# Altium schematic sheet base-board.SchDoc
size A4
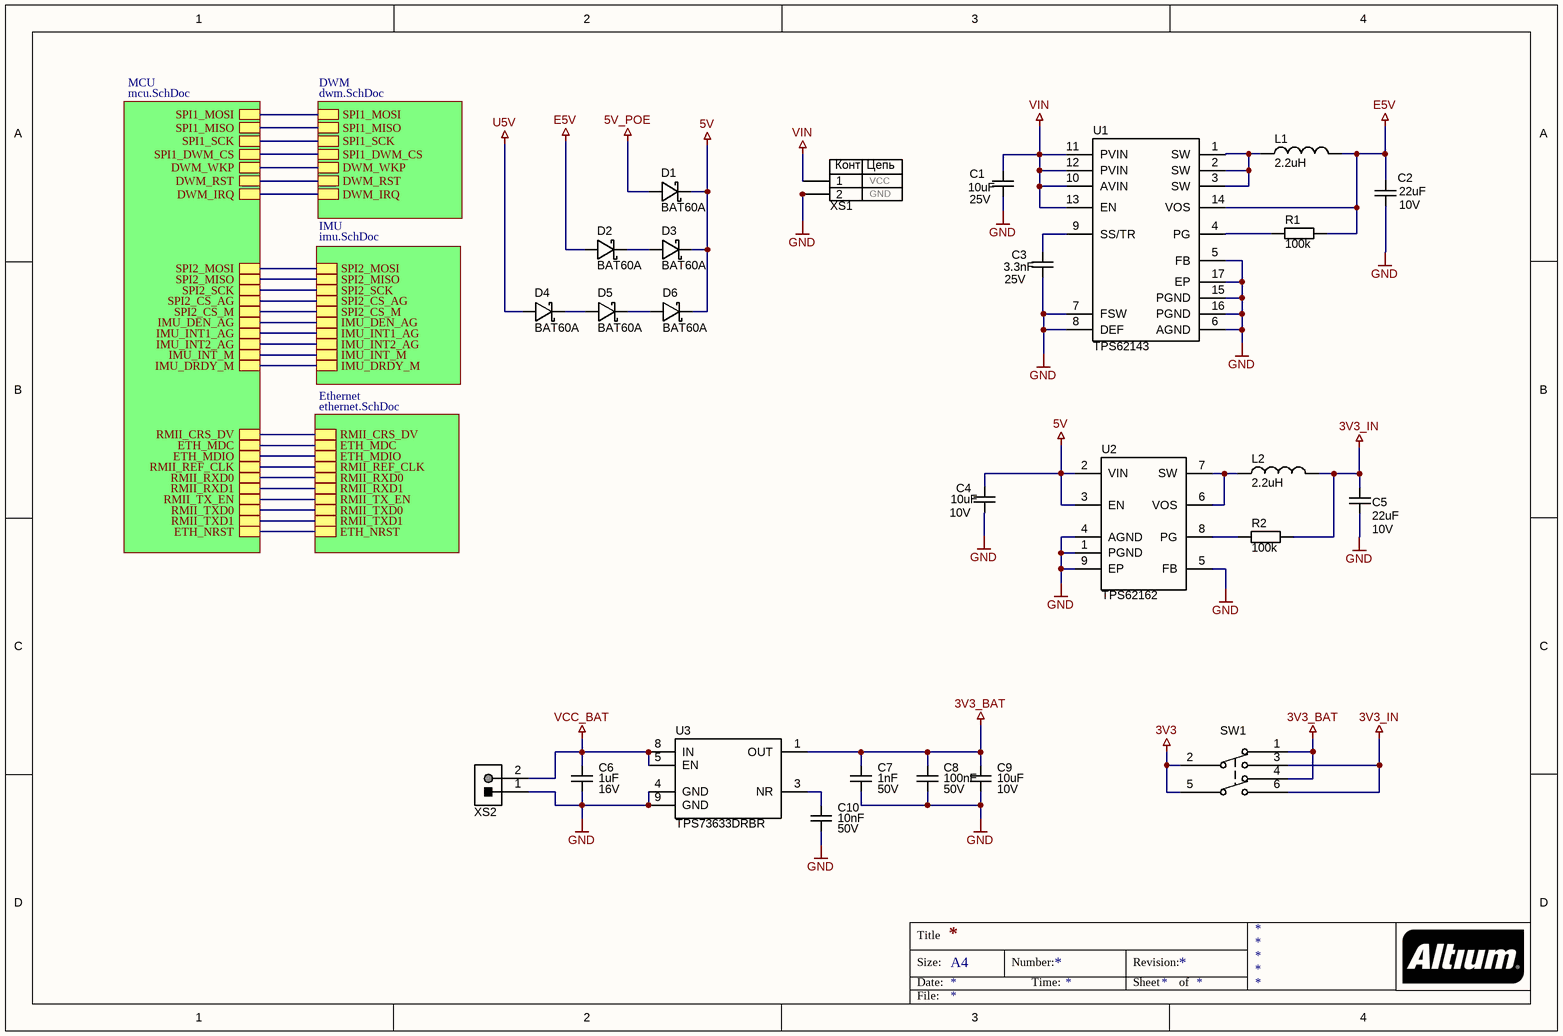
[diagram p0: base-board.SchDoc]

## Parts
C1  value 10uF  Voltage: 25V  [C1210]  (hidden comment: C1210)
C2  value 22uF  Voltage: 10V  [C1210]  (hidden comment: C1210)
C3  value 3.3nF  Voltage: 25V  [C0603]  (hidden comment: C0603)
C4  value 10uF  Voltage: 10V  [C0805]  (hidden comment: C0805)
C5  value 22uF  Voltage: 10V  [C0805]  (hidden comment: C0805)
C6  value 1uF  Voltage: 16V  [C0805]  (hidden comment: C0805)
C7  value 1nF  Voltage: 50V  [C0805]  (hidden comment: C0805)
C8  value 100nF  Voltage: 50V  [C0603]  (hidden comment: C0603)
C9  value 10uF  Voltage: 10V  [C0603]  (hidden comment: C0603)
C10  value 10nF  Voltage: 50V  [C0603]  (hidden comment: C0603)
D1  BAT60A  [SOD-323-2]
D2  BAT60A  [SOD-323-2]
D3  BAT60A  [SOD-323-2]
D4  BAT60A  [SOD-323-2]
D5  BAT60A  [SOD-323-2]
D6  BAT60A  [SOD-323-2]
L1  value 2.2uH  [IND2220]  (hidden comment: LQH55PN2R2NR0)
L2  value 2.2uH  [IND2220]  (hidden comment: LQH55PN2R2NR0)
R1  value 100k  [SMD0603]  (hidden comment: R0603)
R2  value 100k  [SMD0603]  (hidden comment: R0603)
SW1  JS202011SCQN  [JS202011SCQN]  (value not drawn)
U1  TPS62143  [QFN-16]
U2  TPS62162  [SON-8]
U3  TPS73633DRBR  [VSON-8]
XS1  PowerJack  [PowerJack]  (value not drawn)
XS2  S2B-PH-K-S  [S2B-PH-K-S]  (value not drawn)

## Sub-sheets
DWM = dwm.SchDoc: SPI1_MISO, SPI1_MOSI, SPI1_DWM_CS, SPI1_SCK, DWM_WKP, DWM_RST, DWM_IRQ
Ethernet = ethernet.SchDoc: RMII_CRS_DV, ETH_MDC, ETH_MDIO, RMII_REF_CLK, RMII_RXD0, RMII_RXD1, RMII_TX_EN, RMII_TXD0, RMII_TXD1, ETH_NRST
IMU = imu.SchDoc: SPI2_MOSI, SPI2_MISO, SPI2_SCK, SPI2_CS_AG, SPI2_CS_M, IMU_DEN_AG, IMU_INT1_AG, IMU_INT2_AG, IMU_INT_M, IMU_DRDY_M
MCU = mcu.SchDoc: SPI1_MISO, SPI1_MOSI, SPI1_DWM_CS, SPI1_SCK, SPI2_MOSI, SPI2_MISO, SPI2_SCK, SPI2_CS_AG, SPI2_CS_M, IMU_DEN_AG, IMU_INT1_AG, IMU_INT2_AG, IMU_INT_M, IMU_DRDY_M, RMII_CRS_DV, ETH_MDC, ETH_MDIO, RMII_REF_CLK, RMII_RXD0, RMII_RXD1, RMII_TX_EN, RMII_TXD0, RMII_TXD1, DWM_WKP, DWM_RST, DWM_IRQ, ETH_NRST

## Nets
3V3: SW1.2(COM) SW1.5(COM)
3V3_BAT: C7.2 C8.2 C9.2 SW1.1 SW1.4 U3.1(OUT)
3V3_IN: C5.2 L2.2 R2.2 SW1.3 SW1.6
5V: C4.2 D1.2(K) D3.2(K) D6.2(K) U2.2(VIN) U2.3(EN)
5V_POE: D1.1(A)
E5V: C2.2 D2.1(A) L1.2 R1.2 U1.14(VOS)
GND: C1.1 C2.1 C3.1 C4.1 C5.1 C6.1 C7.1 C8.1 C9.1 C10.1 U1.5(FB) U1.6(AGND) U1.7(FSW) U1.8(DEF) U1.15(PGND) U1.16(PGND) U1.17(EP) U2.1(PGND) U2.4(AGND) U2.5(FB) U2.9(EP) U3.4(GND) U3.9(GND) XS1.2 XS1.3 XS2.1
U5V: D4.1(A)
VCC_BAT: C6.2 U3.5(EN) U3.8(IN) XS2.2
VIN: C1.2 U1.10(AVIN) U1.11(PVIN) U1.12(PVIN) U1.13(EN) XS1.1
NetC3_2: C3.2 U1.9(SS/TR)
NetC10_2: C10.2 U3.3(NR)
NetD2_2: D2.2(K) D3.1(A)
NetD4_2: D4.2(K) D5.1(A)
NetD5_2: D5.2(K) D6.1(A)
NetL1_1: L1.1 U1.1(SW) U1.2(SW) U1.3(SW)
NetL2_1: L2.1 U2.6(VOS) U2.7(SW)
NetR1_1: R1.1 U1.4(PG)
NetR2_1: R2.1 U2.8(PG)
(unnamed): sheet MCU/SPI1_MISO, sheet DWM/SPI1_MISO
(unnamed): sheet MCU/SPI1_MOSI, sheet DWM/SPI1_MOSI
(unnamed): sheet MCU/SPI1_DWM_CS, sheet DWM/SPI1_DWM_CS
(unnamed): sheet MCU/SPI1_SCK, sheet DWM/SPI1_SCK
(unnamed): sheet MCU/SPI2_MOSI, sheet IMU/SPI2_MOSI
(unnamed): sheet MCU/SPI2_MISO, sheet IMU/SPI2_MISO
(unnamed): sheet MCU/SPI2_SCK, sheet IMU/SPI2_SCK
(unnamed): sheet MCU/SPI2_CS_AG, sheet IMU/SPI2_CS_AG
(unnamed): sheet MCU/SPI2_CS_M, sheet IMU/SPI2_CS_M
(unnamed): sheet MCU/IMU_DEN_AG, sheet IMU/IMU_DEN_AG
(unnamed): sheet MCU/IMU_INT1_AG, sheet IMU/IMU_INT1_AG
(unnamed): sheet MCU/IMU_INT2_AG, sheet IMU/IMU_INT2_AG
(unnamed): sheet MCU/IMU_INT_M, sheet IMU/IMU_INT_M
(unnamed): sheet MCU/IMU_DRDY_M, sheet IMU/IMU_DRDY_M
(unnamed): sheet MCU/RMII_CRS_DV, sheet Ethernet/RMII_CRS_DV
(unnamed): sheet MCU/ETH_MDC, sheet Ethernet/ETH_MDC
(unnamed): sheet MCU/ETH_MDIO, sheet Ethernet/ETH_MDIO
(unnamed): sheet MCU/RMII_REF_CLK, sheet Ethernet/RMII_REF_CLK
(unnamed): sheet MCU/RMII_RXD0, sheet Ethernet/RMII_RXD0
(unnamed): sheet MCU/RMII_RXD1, sheet Ethernet/RMII_RXD1
(unnamed): sheet MCU/RMII_TX_EN, sheet Ethernet/RMII_TX_EN
(unnamed): sheet MCU/RMII_TXD0, sheet Ethernet/RMII_TXD0
(unnamed): sheet MCU/RMII_TXD1, sheet Ethernet/RMII_TXD1
(unnamed): sheet MCU/DWM_WKP, sheet DWM/DWM_WKP
(unnamed): sheet MCU/DWM_RST, sheet DWM/DWM_RST
(unnamed): sheet MCU/DWM_IRQ, sheet DWM/DWM_IRQ
(unnamed): sheet MCU/ETH_NRST, sheet Ethernet/ETH_NRST

## Notes on the sheet
- Title
- Size:
- Date:
- A4
- Number:
- Time:
- Revision:
- Sheet
- of
- File:
- (in symbol PowerJack) Конт; Цепь; VCC; GND

## Library data of the parts
D1-D6 = BAT60J: Shottky Diode 10V 3A
L1 L2 = LQH55PN2R2NR0: FIXED IND 2.2UH 2.5A 31 MOHM SMD; Model: LQH55PN2R2NR0
SW1 = JS202011SCQN: Switch Slide DPDT, 0.3 A, 6 V, -40 to 85 degC, 6-Pin SMD, RoHS, Tape and Reel; Manufacturer: C&K Components; Contact Rating @ Voltage: 0.3@6VDCA; COO: US; Maximum DC Voltage Rating: 6V; Minimum Insulation Resistance: 100MOhm; Actuator Color: Black; Body Orientation: Straight; Actuator Material: Nylon4/6; Dielectric Strength: 500VAC; Maximum Contact Resistance: 70mOhm; Actuator Style: TopSlide; Electrical Life: 15000Cycles; Seal Location: N/A; Base Material: N/A; Mechanical Life: N/A; Switch Configuration: N/A; HTS: 8536509050; Contact Material: CopperAlloy; Supplier Standard Pack: 5,000; Manufacturer URL: http://www.ckswitches.com; Supplier: C&KComponents; Datasheet URL: http://datasheet.octopart.com/JS202011SCQN-C%26K-Components-datasheet-62100994.pdf; Housing Material: Nylon4/6; Product Weight: N/A; Dimension: 9x7.5x5.5mm; Maximum AC Voltage Rating: N/A; ECCN: EAR99; Contact Plating: Silver; Pole Throw Configuration: DPDT; Packaging: TapeandReel; Part No: JS202011SCQN; Datasheet Version: Sep-15; Seal Description: N/A; RoHS: Yes; Mounting: SurfaceMount,GullWing; Family: JS; Type: Sub-Miniature; Operating Temperature: -40to85C
U1 = TPS62143RGT16: Buck 2A TI Fix 5V
U2 = TPS62162DSG8: Buck 1A TI Fix 3.3V
U3 = TPS73633DRBR: IC REG LINEAR 3.3V 400MA 8SON
XS2 = S2B-PH-K-S: Male Header, Pitch 2 mm, 1 x 2 Position, Height 4.8 mm, Tail Length 3.4 mm, -25 to 85 degC, RoHS, Bulk; Case\Package: Radial; Tolerance: 20%; Capacitance: 10 uF; Voltage Rating (DC): 50 V; Packaging: Bulk; ComponentLink1URL: http://www.jst-mfg.com/product/pdf/eng/ePH.pdf; Radiation Hardening: No; Height: 11 mm; Package Quantity: 200; PackageDescription: Male Header, Pitch 2 mm, 1 x 2 Position, Height 4.8 mm, Tail Length 3.4 mm; PackageReference: S2B-PH-K-S; Diameter: 5 mm; Pins: 2; Mount: Through Hole; Max Operating Temperature: 85 degC; Min Operating Temperature: -40 degC; ComponentLink1Description: Datasheet; DatasheetVersion: Dec-12; Length: 11 mm; Lead Pitch: 2 mm; REACH SVHC: No SVHC; Voltage Rating: 50 V; RoHSCompliant: true
C1 C2 = C1210: Model: *
C3 C8-C10 = C0603: Model: *
C4-C7 = C0805: Model: *